# EAGLE design rart50 (EAGLE 9.6.1)
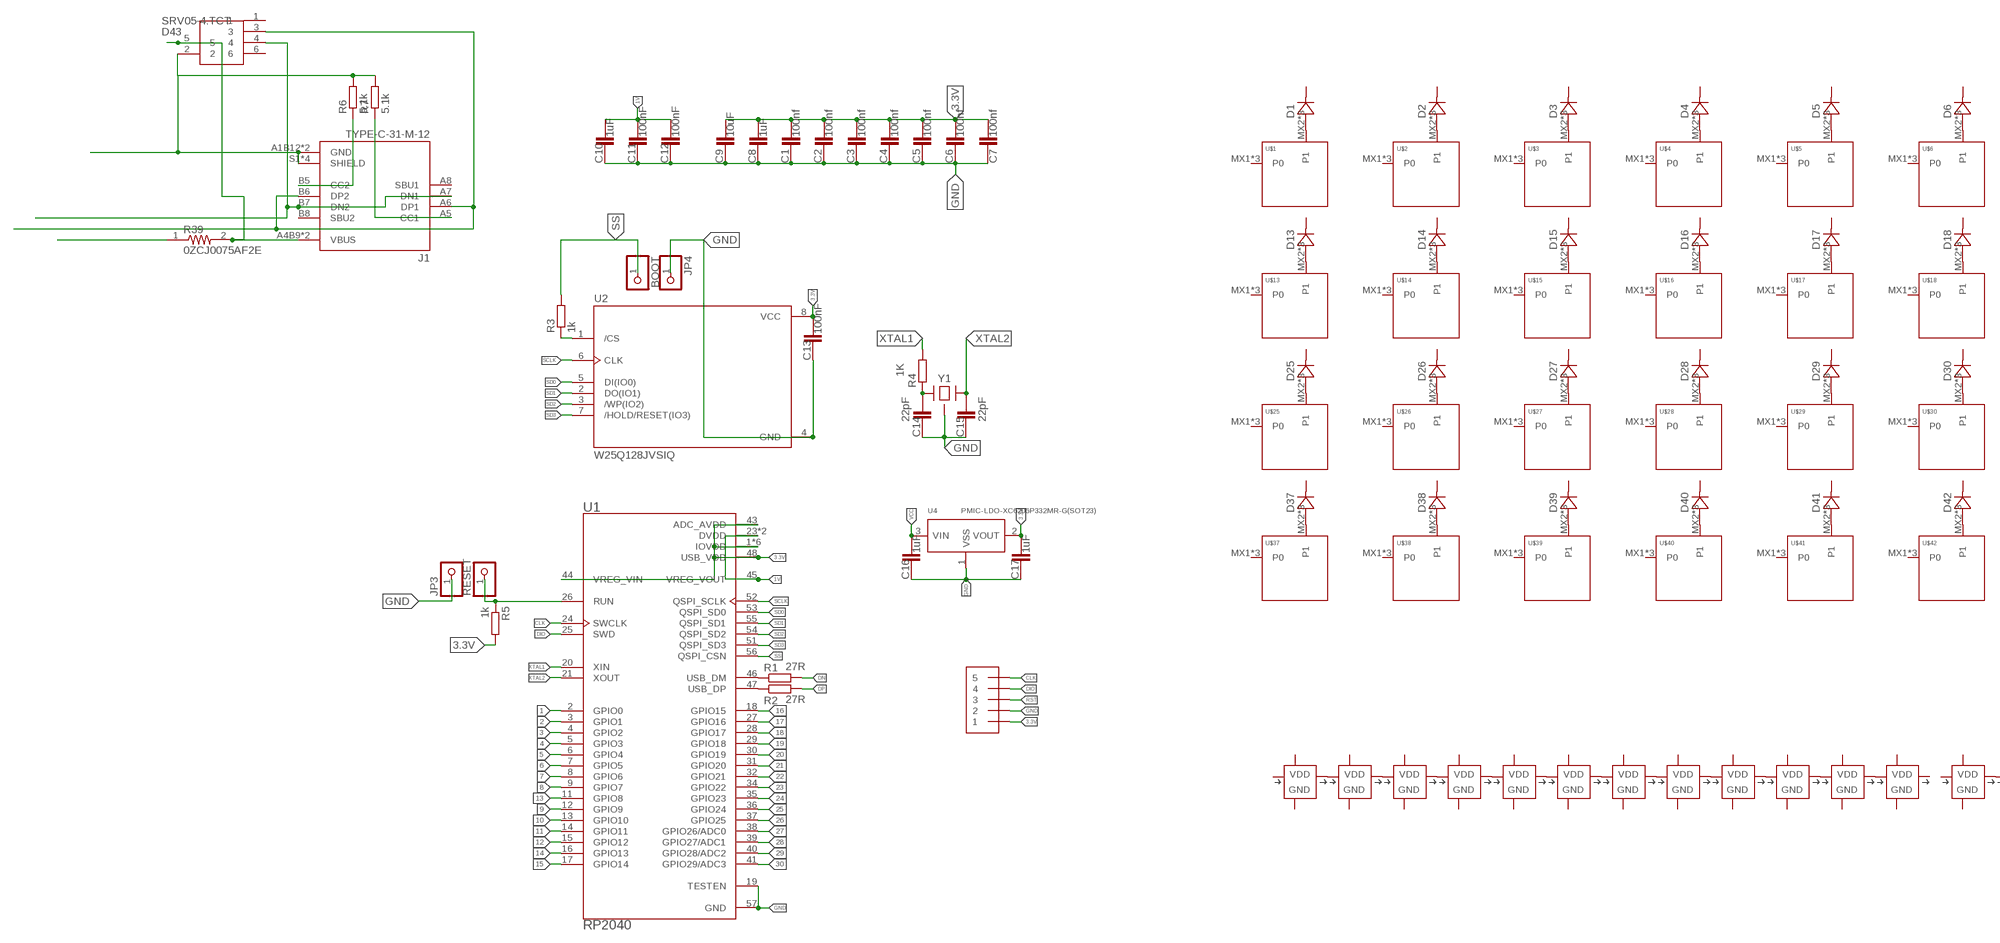
[diagram p0: schematic, sheet 1, part 1 of 2]
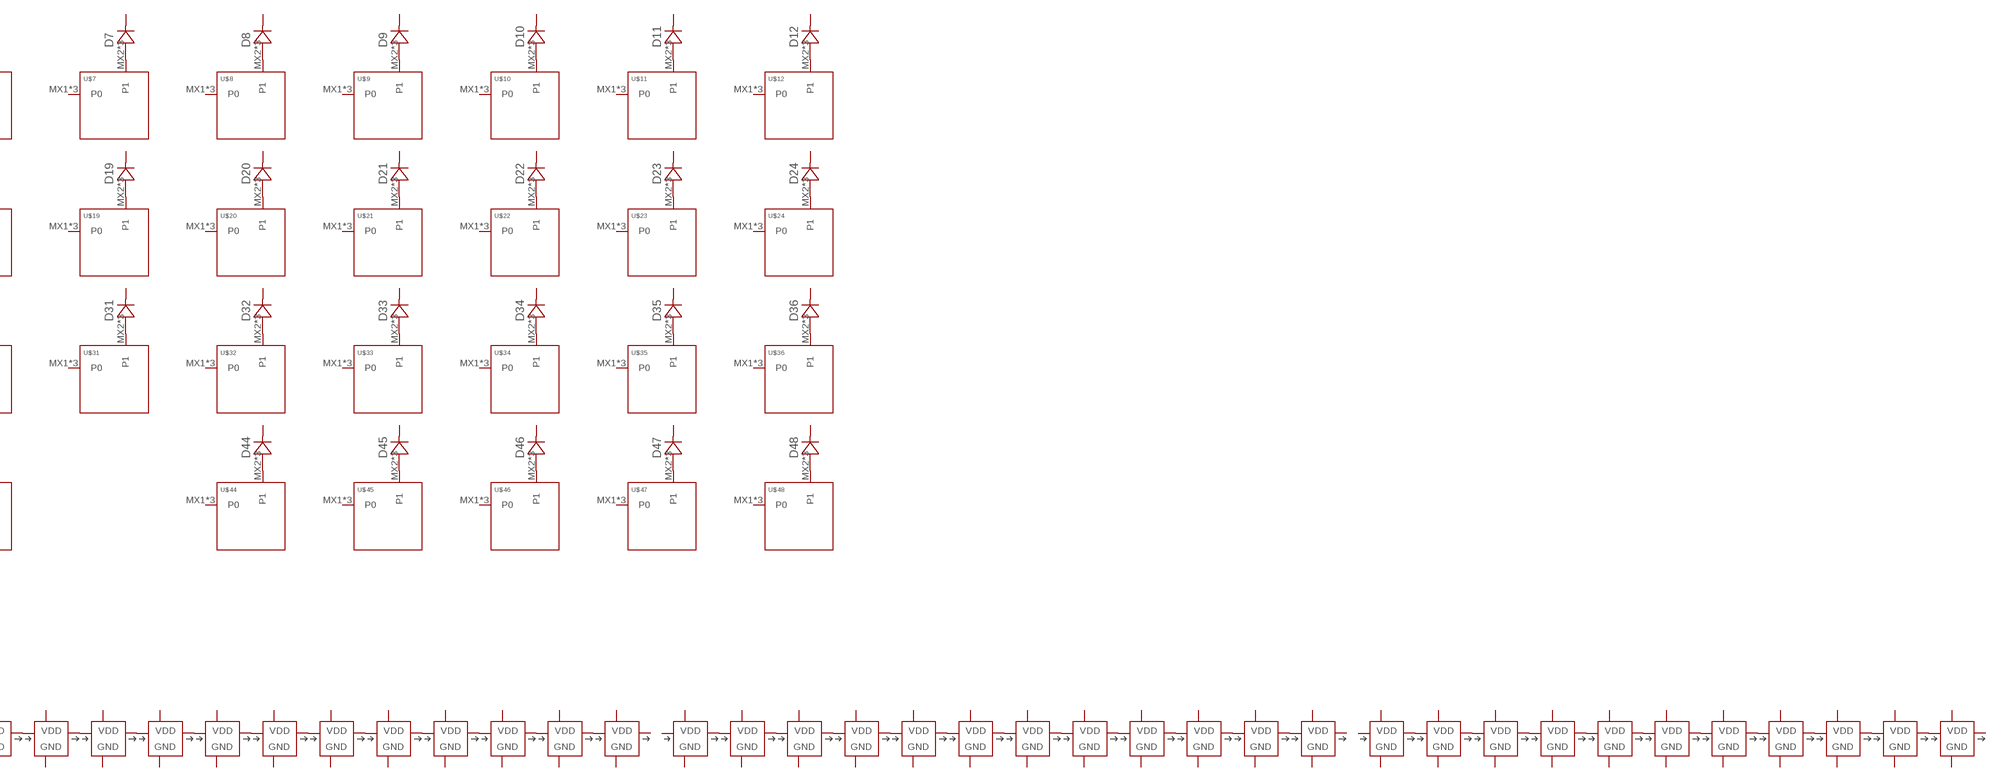
[diagram p1: schematic, sheet 1, part 2 of 2]

## Parts
BOOT  PINHD-1X1  [1X01]
C1  100nf  CAPACITOR-0603  [C0603]
C2  100nf  CAPACITOR-0603  [C0603]
C3  100nf  CAPACITOR-0603  [C0603]
C4  100nf  CAPACITOR-0603  [C0603]
C5  100nf  CAPACITOR-0603  [C0603]
C6  100nf  CAPACITOR-0603  [C0603]
C7  100nf  CAPACITOR-0603  [C0603]
C8  1uF  CAPACITOR-0603  [C0603]
C9  10uF  CAPACITOR-0603  [C0603]
C10  1uF  CAPACITOR-0603  [C0603]
C11  100nF  CAPACITOR-0603  [C0603]
C12  100nF  CAPACITOR-0603  [C0603]
C13  100nF  CAPACITOR-0603  [C0603]
C14  22pF  CAPACITOR-0603  [C0603]
C15  22pF  CAPACITOR-0603  [C0603]
C16  1uF  CAPACITOR-0603  [C0603]
C17  1uF  CAPACITOR-0603  [C0603]
D1  DIODE-SOD-123  [SOD-123]
D2  DIODE-SOD-123  [SOD-123]
D3  DIODE-SOD-123  [SOD-123]
D4  DIODE-SOD-123  [SOD-123]
D5  DIODE-SOD-123  [SOD-123]
D6  DIODE-SOD-123  [SOD-123]
D7  DIODE-SOD-123  [SOD-123]
D8  DIODE-SOD-123  [SOD-123]
D9  DIODE-SOD-123  [SOD-123]
D10  DIODE-SOD-123  [SOD-123]
D11  DIODE-SOD-123  [SOD-123]
D12  DIODE-SOD-123  [SOD-123]
D13  DIODE-SOD-123  [SOD-123]
D14  DIODE-SOD-123  [SOD-123]
D15  DIODE-SOD-123  [SOD-123]
D16  DIODE-SOD-123  [SOD-123]
D17  DIODE-SOD-123  [SOD-123]
D18  DIODE-SOD-123  [SOD-123]
D19  DIODE-SOD-123  [SOD-123]
D20  DIODE-SOD-123  [SOD-123]
D21  DIODE-SOD-123  [SOD-123]
D22  DIODE-SOD-123  [SOD-123]
D23  DIODE-SOD-123  [SOD-123]
D24  DIODE-SOD-123  [SOD-123]
D25  DIODE-SOD-123  [SOD-123]
D26  DIODE-SOD-123  [SOD-123]
D27  DIODE-SOD-123  [SOD-123]
D28  DIODE-SOD-123  [SOD-123]
D29  DIODE-SOD-123  [SOD-123]
D30  DIODE-SOD-123  [SOD-123]
D31  DIODE-SOD-123  [SOD-123]
D32  DIODE-SOD-123  [SOD-123]
D33  DIODE-SOD-123  [SOD-123]
D34  DIODE-SOD-123  [SOD-123]
D35  DIODE-SOD-123  [SOD-123]
D36  DIODE-SOD-123  [SOD-123]
D37  DIODE-SOD-123  [SOD-123]
D38  DIODE-SOD-123  [SOD-123]
D39  DIODE-SOD-123  [SOD-123]
D40  DIODE-SOD-123  [SOD-123]
D41  DIODE-SOD-123  [SOD-123]
D42  DIODE-SOD-123  [SOD-123]
D43  SRV05-4.TCT  [SOT95P280X145-6N]
D44  DIODE-SOD-123  [SOD-123]
D45  DIODE-SOD-123  [SOD-123]
D46  DIODE-SOD-123  [SOD-123]
D47  DIODE-SOD-123  [SOD-123]
D48  DIODE-SOD-123  [SOD-123]
J1  TYPE-C-31-M-12  [HRO_TYPE-C-31-M-12]
J2  1X5  [1X05-3.5MM]
JP3  PINHD-1X1CB  [1X01-CLEANBIG]
JP4  PINHD-1X1CB  [1X01-CLEANBIG]
R1  27R  RESISTOR-0603  [R0603]
R2  27R  RESISTOR-0603  [R0603]
R3  1k  RESISTOR-0603  [R0603]
R4  1K  RESISTOR-0603  [R0603]
R5  1k  RESISTOR-0603  [R0603]
R6  5.1k  RESISTOR-0603  [R0603]
R7  5.1k  RESISTOR-0603  [R0603]
R39  0ZCJ0075AF2E  [RESC3216X125N]
RESET  PINHD-1X1  [1X01]
U1  RP2040  [QFN40P700X700X90-57N]
U2  W25Q128JVSIQ  [SOIC127P790X216-8N]
U4  PMIC-LDO-XC6206P332MR-G(SOT23)  [SOT-23]
U$1  KEYSWITCH-PLAIN-MXHSPCB-1U  [MXHSPCB-1U]
U$2  KEYSWITCH-PLAIN-MXHSPCB-1U  [MXHSPCB-1U]
U$3  KEYSWITCH-PLAIN-MXHSPCB-1U  [MXHSPCB-1U]
U$4  KEYSWITCH-PLAIN-MXHSPCB-1U  [MXHSPCB-1U]
U$5  KEYSWITCH-PLAIN-MXHSPCB-1U  [MXHSPCB-1U]
U$6  KEYSWITCH-PLAIN-MXHSPCB-1U  [MXHSPCB-1U]
U$7  KEYSWITCH-PLAIN-MXHSPCB-1U  [MXHSPCB-1U]
U$8  KEYSWITCH-PLAIN-MXHSPCB-1U  [MXHSPCB-1U]
U$9  KEYSWITCH-PLAIN-MXHSPCB-1U  [MXHSPCB-1U]
U$10  KEYSWITCH-PLAIN-MXHSPCB-1U  [MXHSPCB-1U]
U$11  KEYSWITCH-PLAIN-MXHSPCB-1U  [MXHSPCB-1U]
U$12  KEYSWITCH-PLAIN-MXHSPCB-1U  [MXHSPCB-1U]
U$13  KEYSWITCH-PLAIN-MXHSPCB-1U  [MXHSPCB-1U]
U$14  KEYSWITCH-PLAIN-MXHSPCB-1U  [MXHSPCB-1U]
U$15  KEYSWITCH-PLAIN-MXHSPCB-1U  [MXHSPCB-1U]
U$16  KEYSWITCH-PLAIN-MXHSPCB-1U  [MXHSPCB-1U]
U$17  KEYSWITCH-PLAIN-MXHSPCB-1U  [MXHSPCB-1U]
U$18  KEYSWITCH-PLAIN-MXHSPCB-1U  [MXHSPCB-1U]
U$19  KEYSWITCH-PLAIN-MXHSPCB-1U  [MXHSPCB-1U]
U$20  KEYSWITCH-PLAIN-MXHSPCB-1U  [MXHSPCB-1U]
U$21  KEYSWITCH-PLAIN-MXHSPCB-1U  [MXHSPCB-1U]
U$22  KEYSWITCH-PLAIN-MXHSPCB-1U  [MXHSPCB-1U]
U$23  KEYSWITCH-PLAIN-MXHSPCB-1U  [MXHSPCB-1U]
U$24  KEYSWITCH-PLAIN-MXHSPCB-1U  [MXHSPCB-1U]
U$25  KEYSWITCH-PLAIN-MXHSPCB-1U  [MXHSPCB-1U]
U$26  KEYSWITCH-PLAIN-MXHSPCB-1U  [MXHSPCB-1U]
U$27  KEYSWITCH-PLAIN-MXHSPCB-1U  [MXHSPCB-1U]
U$28  KEYSWITCH-PLAIN-MXHSPCB-1U  [MXHSPCB-1U]
U$29  KEYSWITCH-PLAIN-MXHSPCB-1U  [MXHSPCB-1U]
U$30  KEYSWITCH-PLAIN-MXHSPCB-1U  [MXHSPCB-1U]
U$31  KEYSWITCH-PLAIN-MXHSPCB-1U  [MXHSPCB-1U]
U$32  KEYSWITCH-PLAIN-MXHSPCB-1U  [MXHSPCB-1U]
U$33  KEYSWITCH-PLAIN-MXHSPCB-1U  [MXHSPCB-1U]
U$34  KEYSWITCH-PLAIN-MXHSPCB-1U  [MXHSPCB-1U]
U$35  KEYSWITCH-PLAIN-MXHSPCB-1U  [MXHSPCB-1U]
U$36  KEYSWITCH-PLAIN-MXHSPCB-1U  [MXHSPCB-1U]
U$37  KEYSWITCH-PLAIN-MXHSPCB-1U  [MXHSPCB-1U]
U$38  KEYSWITCH-PLAIN-MXHSPCB-1U  [MXHSPCB-1U]
U$39  KEYSWITCH-PLAIN-MXHSPCB-1U  [MXHSPCB-1U]
U$40  KEYSWITCH-PLAIN-MXHSPCB-1U  [MXHSPCB-1U]
U$41  KEYSWITCH-PLAIN-MXHSPCB-1U  [MXHSPCB-1U]
U$42  KEYSWITCH-PLAIN-MXHSPCB-2U-FLIPPED  [MXHSPCB-2U-FLIPPED]
U$43  SK6812MINI  [LED-3535]
U$44  KEYSWITCH-PLAIN-MXHSPCB-1U  [MXHSPCB-1U]
U$45  KEYSWITCH-PLAIN-MXHSPCB-1U  [MXHSPCB-1U]
U$46  KEYSWITCH-PLAIN-MXHSPCB-1U  [MXHSPCB-1U]
U$47  KEYSWITCH-PLAIN-MXHSPCB-1U  [MXHSPCB-1U]
U$48  KEYSWITCH-PLAIN-MXHSPCB-1U  [MXHSPCB-1U]
U$49  SK6812MINI  [LED-3535]
U$50  SK6812MINI  [LED-3535]
U$51  SK6812MINI  [LED-3535]
U$52  SK6812MINI  [LED-3535]
U$53  SK6812MINI  [LED-3535]
U$54  SK6812MINI  [LED-3535]
U$55  SK6812MINI  [LED-3535]
U$56  SK6812MINI  [LED-3535]
U$57  SK6812MINI  [LED-3535]
U$58  SK6812MINI  [LED-3535]
U$59  SK6812MINI  [LED-3535]
U$60  SK6812MINI  [LED-3535]
U$61  SK6812MINI  [LED-3535]
U$62  SK6812MINI  [LED-3535]
U$63  SK6812MINI  [LED-3535]
U$64  SK6812MINI  [LED-3535]
U$65  SK6812MINI  [LED-3535]
U$66  SK6812MINI  [LED-3535]
U$67  SK6812MINI  [LED-3535]
U$68  SK6812MINI  [LED-3535]
U$69  SK6812MINI  [LED-3535]
U$70  SK6812MINI  [LED-3535]
U$71  SK6812MINI  [LED-3535]
U$72  SK6812MINI  [LED-3535]
U$73  SK6812MINI  [LED-3535]
U$74  SK6812MINI  [LED-3535]
U$75  SK6812MINI  [LED-3535]
U$76  SK6812MINI  [LED-3535]
U$77  SK6812MINI  [LED-3535]
U$78  SK6812MINI  [LED-3535]
U$79  SK6812MINI  [LED-3535]
U$80  SK6812MINI  [LED-3535]
U$81  SK6812MINI  [LED-3535]
U$82  SK6812MINI  [LED-3535]
U$83  SK6812MINI  [LED-3535]
U$84  SK6812MINI  [LED-3535]
U$85  SK6812MINI  [LED-3535]
U$86  SK6812MINI  [LED-3535]
U$87  SK6812MINI  [LED-3535]
U$88  SK6812MINI  [LED-3535]
U$89  SK6812MINI  [LED-3535]
U$90  SK6812MINI  [LED-3535]
U$91  SK6812MINI  [LED-3535]
U$92  SK6812MINI  [LED-3535]
U$93  SK6812MINI  [LED-3535]
U$94  SK6812MINI  [LED-3535]
Y1  CRYSTAL-4PIN-3.2X2.5  [CRYSTAL-3.2X2.5]

## Nets
1: U1.2(GPIO0)
1V: C10.2 C11.2 C12.2 U1.23(DVDD) U1.45(VREG_VOUT) U1.50(DVDD)
2: U1.3(GPIO1)
3: U1.4(GPIO2)
3.3V: C1.2 C2.2 C3.2 C4.2 C5.2 C6.2 C7.2 C8.2 C9.2 C13.2 C17.2 J2.1 R5.2 U1.1(IOVDD) U1.10(IOVDD) U1.22(IOVDD) U1.33(IOVDD) U1.42(IOVDD) U1.43(ADC_AVDD) U1.44(VREG_VIN) U1.48(USB_VDD) U1.49(IOVDD) U2.8(VCC) U4.2(VOUT)
4: U1.5(GPIO3)
5: U1.6(GPIO4)
6: U1.7(GPIO5)
7: U1.8(GPIO6)
8: U1.9(GPIO7)
9: U1.12(GPIO9)
10: U1.13(GPIO10)
11: U1.14(GPIO11)
12: U1.15(GPIO12)
13: U1.11(GPIO8)
14: U1.16(GPIO13)
15: U1.17(GPIO14)
16: U1.18(GPIO15)
17: U1.27(GPIO16)
18: U1.28(GPIO17)
19: U1.29(GPIO18)
20: U1.30(GPIO19)
21: U1.31(GPIO20)
22: U1.32(GPIO21)
23: U1.34(GPIO22)
24: U1.35(GPIO23)
25: U1.36(GPIO24)
26: U1.37(GPIO25)
27: U1.38(GPIO26/ADC0)
28: U1.39(GPIO27/ADC1)
29: U1.40(GPIO28/ADC2)
30: U1.41(GPIO29/ADC3)
CLK: J2.5 U1.24(SWCLK)
DIO: J2.4 U1.25(SWD)
DN: R1.2
DN-: D43.4 J1.A7(DN1) J1.B7(DN2)
DP: R2.2
DP+: D43.3 J1.A6(DP1) J1.B6(DP2)
GND: C1.1 C2.1 C3.1 C4.1 C5.1 C6.1 C7.1 C8.1 C9.1 C10.1 C11.1 C12.1 C13.1 C14.1 C15.1 C16.1 C17.1 J2.2 JP3.1 JP4.1 U1.19(TESTEN) U1.57(GND) U2.4(GND) U4.1(VSS) Y1.2(GND) Y1.4(GND)
GND1: D43.2 J1.A1B12(GND) J1.B1A12(GND) J1.S1(SHIELD) J1.S2(SHIELD) J1.S3(SHIELD) J1.S4(SHIELD) R6.2 R7.2
N$7: D1.A U$1.MX2(P1) U$1.P$3(P1) U$1.P$4(P1)
N$8: D2.A U$2.MX2(P1) U$2.P$3(P1) U$2.P$4(P1)
N$9: D3.A U$3.MX2(P1) U$3.P$3(P1) U$3.P$4(P1)
N$10: D4.A U$4.MX2(P1) U$4.P$3(P1) U$4.P$4(P1)
N$11: D5.A U$5.MX2(P1) U$5.P$3(P1) U$5.P$4(P1)
N$12: D6.A U$6.MX2(P1) U$6.P$3(P1) U$6.P$4(P1)
N$13: D7.A U$7.MX2(P1) U$7.P$3(P1) U$7.P$4(P1)
N$14: D8.A U$8.MX2(P1) U$8.P$3(P1) U$8.P$4(P1)
N$15: D9.A U$9.MX2(P1) U$9.P$3(P1) U$9.P$4(P1)
N$16: D10.A U$10.MX2(P1) U$10.P$3(P1) U$10.P$4(P1)
N$17: D11.A U$11.MX2(P1) U$11.P$3(P1) U$11.P$4(P1)
N$18: D12.A U$12.MX2(P1) U$12.P$3(P1) U$12.P$4(P1)
N$19: D13.A U$13.MX2(P1) U$13.P$3(P1) U$13.P$4(P1)
N$20: D14.A U$14.MX2(P1) U$14.P$3(P1) U$14.P$4(P1)
N$21: D15.A U$15.MX2(P1) U$15.P$3(P1) U$15.P$4(P1)
N$22: D16.A U$16.MX2(P1) U$16.P$3(P1) U$16.P$4(P1)
N$23: D17.A U$17.MX2(P1) U$17.P$3(P1) U$17.P$4(P1)
N$24: D18.A U$18.MX2(P1) U$18.P$3(P1) U$18.P$4(P1)
N$25: D19.A U$19.MX2(P1) U$19.P$3(P1) U$19.P$4(P1)
N$26: D20.A U$20.MX2(P1) U$20.P$3(P1) U$20.P$4(P1)
N$27: D21.A U$21.MX2(P1) U$21.P$3(P1) U$21.P$4(P1)
N$28: D22.A U$22.MX2(P1) U$22.P$3(P1) U$22.P$4(P1)
N$29: D23.A U$23.MX2(P1) U$23.P$3(P1) U$23.P$4(P1)
N$30: D24.A U$24.MX2(P1) U$24.P$3(P1) U$24.P$4(P1)
N$31: D25.A U$25.MX2(P1) U$25.P$3(P1) U$25.P$4(P1)
N$32: D26.A U$26.MX2(P1) U$26.P$3(P1) U$26.P$4(P1)
N$33: D27.A U$27.MX2(P1) U$27.P$3(P1) U$27.P$4(P1)
N$34: D28.A U$28.MX2(P1) U$28.P$3(P1) U$28.P$4(P1)
N$35: D29.A U$29.MX2(P1) U$29.P$3(P1) U$29.P$4(P1)
N$36: D30.A U$30.MX2(P1) U$30.P$3(P1) U$30.P$4(P1)
N$37: D31.A U$31.MX2(P1) U$31.P$3(P1) U$31.P$4(P1)
N$38: D32.A U$32.MX2(P1) U$32.P$3(P1) U$32.P$4(P1)
N$39: D33.A U$33.MX2(P1) U$33.P$3(P1) U$33.P$4(P1)
N$40: D34.A U$34.MX2(P1) U$34.P$3(P1) U$34.P$4(P1)
N$41: D35.A U$35.MX2(P1) U$35.P$3(P1) U$35.P$4(P1)
N$42: D36.A U$36.MX2(P1) U$36.P$3(P1) U$36.P$4(P1)
N$43: D37.A U$37.MX2(P1) U$37.P$3(P1) U$37.P$4(P1)
N$44: D38.A U$38.MX2(P1) U$38.P$3(P1) U$38.P$4(P1)
N$45: D39.A U$39.MX2(P1) U$39.P$3(P1) U$39.P$4(P1)
N$46: D40.A U$40.MX2(P1) U$40.P$3(P1) U$40.P$4(P1)
N$47: D41.A U$41.MX2(P1) U$41.P$3(P1) U$41.P$4(P1)
N$48: D42.A U$42.MX2(P1) U$42.P$3(P1) U$42.P$4(P1)
N$49: D44.A U$44.MX2(P1) U$44.P$3(P1) U$44.P$4(P1)
N$50: D45.A U$45.MX2(P1) U$45.P$3(P1) U$45.P$4(P1)
N$51: D46.A U$46.MX2(P1) U$46.P$3(P1) U$46.P$4(P1)
N$52: D47.A U$47.MX2(P1) U$47.P$3(P1) U$47.P$4(P1)
N$53: D48.A U$48.MX2(P1) U$48.P$3(P1) U$48.P$4(P1)
N$54: U$43.3(DO) U$49.1(DI)
N$55: U$49.3(DO) U$50.1(DI)
N$56: U$50.3(DO) U$51.1(DI)
N$57: U$51.3(DO) U$52.1(DI)
N$58: U$52.3(DO) U$53.1(DI)
N$59: U$53.3(DO) U$54.1(DI)
N$60: U$54.3(DO) U$55.1(DI)
N$61: U$55.3(DO) U$56.1(DI)
N$62: U$56.3(DO) U$57.1(DI)
N$63: U$57.3(DO) U$58.1(DI)
N$64: U$58.3(DO) U$59.1(DI)
N$65: U$60.3(DO) U$61.1(DI)
N$66: U$61.3(DO) U$62.1(DI)
N$67: U$62.3(DO) U$63.1(DI)
N$68: U$63.3(DO) U$64.1(DI)
N$69: U$64.3(DO) U$65.1(DI)
N$70: U$65.3(DO) U$66.1(DI)
N$71: U$66.3(DO) U$67.1(DI)
N$72: U$67.3(DO) U$68.1(DI)
N$73: U$68.3(DO) U$69.1(DI)
N$74: U$69.3(DO) U$70.1(DI)
N$75: U$70.3(DO) U$71.1(DI)
N$76: U$72.3(DO) U$73.1(DI)
N$77: U$73.3(DO) U$74.1(DI)
N$78: U$74.3(DO) U$75.1(DI)
N$79: U$75.3(DO) U$76.1(DI)
N$80: U$76.3(DO) U$77.1(DI)
N$81: U$77.3(DO) U$78.1(DI)
N$82: U$78.3(DO) U$79.1(DI)
N$83: U$79.3(DO) U$80.1(DI)
N$84: U$80.3(DO) U$81.1(DI)
N$85: U$81.3(DO) U$82.1(DI)
N$86: U$82.3(DO) U$83.1(DI)
N$87: U$84.3(DO) U$85.1(DI)
N$88: U$85.3(DO) U$86.1(DI)
N$89: U$86.3(DO) U$87.1(DI)
N$90: U$87.3(DO) U$88.1(DI)
N$91: U$88.3(DO) U$89.1(DI)
N$92: U$89.3(DO) U$90.1(DI)
N$93: U$90.3(DO) U$91.1(DI)
N$94: U$91.3(DO) U$92.1(DI)
N$95: U$92.3(DO) U$93.1(DI)
N$96: U$93.3(DO) U$94.1(DI)
N$97: R1.1 U1.46(USB_DM)
N$98: R2.1 U1.47(USB_DP)
N$99: C14.2 R4.1 Y1.1
N$100: R3.1 U2.1(/CS)
N$101: D43.5 J1.A4B9(VBUS) J1.B4A9(VBUS) R39.2
N$153: J1.B5(CC2) R6.1
N$154: J1.A5(CC1) R7.1
RST: J2.3 R5.1 RESET.1 U1.26(RUN)
SCLK: U1.52(QSPI_SCLK) U2.6(CLK)
SD0: U1.53(QSPI_SD0) U2.5(DI(IO0))
SD1: U1.55(QSPI_SD1) U2.2(DO(IO1))
SD2: U1.54(QSPI_SD2) U2.3(/WP(IO2))
SD3: U1.51(QSPI_SD3) U2.7(/HOLD/RESET(IO3))
SS: BOOT.1 R3.2 U1.56(QSPI_CSN)
VCC: C16.2 U4.3(VIN)
VCC1: R39.1
XTAL1: R4.2 U1.20(XIN)
XTAL2: C15.2 U1.21(XOUT) Y1.3
Unconnected: D1.C D2.C D3.C D4.C D5.C D6.C D7.C D8.C D9.C D10.C D11.C D12.C D13.C D14.C D15.C D16.C D17.C D18.C D19.C D20.C D21.C D22.C D23.C D24.C D25.C D26.C D27.C D28.C D29.C D30.C D31.C D32.C D33.C D34.C D35.C D36.C D37.C D38.C D39.C D40.C D41.C D42.C D43.1 D43.6 D44.C D45.C D46.C D47.C D48.C J1.A8(SBU1) J1.B8(SBU2) U$1.MX1(P0) U$1.P$1(P0) U$1.P$2(P0) U$2.MX1(P0) U$2.P$1(P0) U$2.P$2(P0) U$3.MX1(P0) U$3.P$1(P0) U$3.P$2(P0) U$4.MX1(P0) U$4.P$1(P0) U$4.P$2(P0) U$5.MX1(P0) U$5.P$1(P0) U$5.P$2(P0) U$6.MX1(P0) U$6.P$1(P0) U$6.P$2(P0) U$7.MX1(P0) U$7.P$1(P0) U$7.P$2(P0) U$8.MX1(P0) U$8.P$1(P0) U$8.P$2(P0) U$9.MX1(P0) U$9.P$1(P0) U$9.P$2(P0) U$10.MX1(P0) U$10.P$1(P0) U$10.P$2(P0) U$11.MX1(P0) U$11.P$1(P0) U$11.P$2(P0) U$12.MX1(P0) U$12.P$1(P0) U$12.P$2(P0) U$13.MX1(P0) U$13.P$1(P0) U$13.P$2(P0) U$14.MX1(P0) U$14.P$1(P0) U$14.P$2(P0) U$15.MX1(P0) U$15.P$1(P0) U$15.P$2(P0) U$16.MX1(P0) U$16.P$1(P0) U$16.P$2(P0) U$17.MX1(P0) U$17.P$1(P0) U$17.P$2(P0) U$18.MX1(P0) U$18.P$1(P0) U$18.P$2(P0) U$19.MX1(P0) U$19.P$1(P0) U$19.P$2(P0) U$20.MX1(P0) U$20.P$1(P0) U$20.P$2(P0) U$21.MX1(P0) U$21.P$1(P0) U$21.P$2(P0) U$22.MX1(P0) U$22.P$1(P0) U$22.P$2(P0) U$23.MX1(P0) U$23.P$1(P0) U$23.P$2(P0) U$24.MX1(P0) U$24.P$1(P0) U$24.P$2(P0) U$25.MX1(P0) U$25.P$1(P0) U$25.P$2(P0) U$26.MX1(P0) U$26.P$1(P0) U$26.P$2(P0) U$27.MX1(P0) U$27.P$1(P0) U$27.P$2(P0) U$28.MX1(P0) U$28.P$1(P0) U$28.P$2(P0) U$29.MX1(P0) U$29.P$1(P0) U$29.P$2(P0) U$30.MX1(P0) U$30.P$1(P0) U$30.P$2(P0) U$31.MX1(P0) U$31.P$1(P0) U$31.P$2(P0) U$32.MX1(P0) U$32.P$1(P0) U$32.P$2(P0) U$33.MX1(P0) U$33.P$1(P0) U$33.P$2(P0) U$34.MX1(P0) U$34.P$1(P0) U$34.P$2(P0) U$35.MX1(P0) U$35.P$1(P0) U$35.P$2(P0) U$36.MX1(P0) U$36.P$1(P0) U$36.P$2(P0) U$37.MX1(P0) U$37.P$1(P0) U$37.P$2(P0) U$38.MX1(P0) U$38.P$1(P0) U$38.P$2(P0) U$39.MX1(P0) U$39.P$1(P0) U$39.P$2(P0) U$40.MX1(P0) U$40.P$1(P0) U$40.P$2(P0) U$41.MX1(P0) U$41.P$1(P0) U$41.P$2(P0) U$42.MX1(P0) U$42.P$1(P0) U$42.P$2(P0) U$43.1(DI) U$44.MX1(P0) U$44.P$1(P0) U$44.P$2(P0) U$45.MX1(P0) U$45.P$1(P0) U$45.P$2(P0) U$46.MX1(P0) U$46.P$1(P0) U$46.P$2(P0) U$47.MX1(P0) U$47.P$1(P0) U$47.P$2(P0) U$48.MX1(P0) U$48.P$1(P0) U$48.P$2(P0) U$59.3(DO) U$60.1(DI) U$71.3(DO) U$72.1(DI) U$83.3(DO) U$84.1(DI) U$94.3(DO)

## Power pins joined to a net without a drawn wire
GND: U$43.2(GND) U$49.2(GND) U$50.2(GND) U$51.2(GND) U$52.2(GND) U$53.2(GND) U$54.2(GND) U$55.2(GND) U$56.2(GND) U$57.2(GND) U$58.2(GND) U$59.2(GND) U$60.2(GND) U$61.2(GND) U$62.2(GND) U$63.2(GND) U$64.2(GND) U$65.2(GND) U$66.2(GND) U$67.2(GND) U$68.2(GND) U$69.2(GND) U$70.2(GND) U$71.2(GND) U$72.2(GND) U$73.2(GND) U$74.2(GND) U$75.2(GND) U$76.2(GND) U$77.2(GND) U$78.2(GND) U$79.2(GND) U$80.2(GND) U$81.2(GND) U$82.2(GND) U$83.2(GND) U$84.2(GND) U$85.2(GND) U$86.2(GND) U$87.2(GND) U$88.2(GND) U$89.2(GND) U$90.2(GND) U$91.2(GND) U$92.2(GND) U$93.2(GND) U$94.2(GND)
VDD: U$43.4(VDD) U$49.4(VDD) U$50.4(VDD) U$51.4(VDD) U$52.4(VDD) U$53.4(VDD) U$54.4(VDD) U$55.4(VDD) U$56.4(VDD) U$57.4(VDD) U$58.4(VDD) U$59.4(VDD) U$60.4(VDD) U$61.4(VDD) U$62.4(VDD) U$63.4(VDD) U$64.4(VDD) U$65.4(VDD) U$66.4(VDD) U$67.4(VDD) U$68.4(VDD) U$69.4(VDD) U$70.4(VDD) U$71.4(VDD) U$72.4(VDD) U$73.4(VDD) U$74.4(VDD) U$75.4(VDD) U$76.4(VDD) U$77.4(VDD) U$78.4(VDD) U$79.4(VDD) U$80.4(VDD) U$81.4(VDD) U$82.4(VDD) U$83.4(VDD) U$84.4(VDD) U$85.4(VDD) U$86.4(VDD) U$87.4(VDD) U$88.4(VDD) U$89.4(VDD) U$90.4(VDD) U$91.4(VDD) U$92.4(VDD) U$93.4(VDD) U$94.4(VDD)

## Library data of the parts
BOOT JP3 JP4 RESET = adafruit:PINHD-1X1: Pin header 1x1 for 0.1" spacing With round pins
C1-C17 = Components:CAPACITOR
D1-D42 D44-D48 = Components:DIODE: Standard 1N4148 diode
D43 = SRV05-4.TCT:SRV05-4.TCT: Semtech SRV05-4.TCT, Uni-Directional TVS Diode Array, 300W, 6-Pin SOT-23 Source: Datasheet <https://componentsearchengine.com/Datasheets/1/SRV05-4.TCT.pdf> Check prices <https://pricing.snapeda.com/parts/SRV05-4.TC/Semtech/view-part?ref=eda>; AVAILABILITY: In Stock; DESCRIPTION: 17.5V Clamp 12A (8/20µs) Ipp Tvs Diode Surface Mount SOT-23-6; MF: Semtech; MP: SRV05-4.TC; PACKAGE: SOT-23-6 Semtech; PRICE: None; PURCHASE-URL: https://pricing.snapeda.com/search/part/SRV05-4.TC/?ref=eda
J1 = TYPE-C-31-M-12:TYPE-C-31-M-12: USB Connectors 24 Receptacle 1 8.94*7.3mm RoHS; AVAILABILITY: Unavailable; DESCRIPTION: USB Connectors 24 Receptacle 1 8.94*7.3mm RoHS; MF: HRO Electronics Co., Ltd.; MP: TYPE-C-31-M-12; PACKAGE: Package; PRICE: None
J2 = adafruit:1X5
R1-R7 = Components:RESISTOR
R39 = fuse:0ZCJ0075AF2E: PTC RESTTBLE 0.75A 16V CHIP 1206 Check prices <https://pricing.snapeda.com/parts/0ZCJ0075AF2E/Bel%20Fuse/view-part?ref=eda>; AVAILABILITY: In Stock; DESCRIPTION: 1206 SMT PPTC | 0.75 Ih | 16V; MF: Bel Fuse; MP: 0ZCJ0075AF2E; PACKAGE: 1206 Bel Fuse; PRICE: None; PURCHASE-URL: https://pricing.snapeda.com/search/part/0ZCJ0075AF2E/?ref=eda
U1 = RP2040:RP2040: Check availability <https://pricing.snapeda.com/parts/RP2040/Raspberry%20Pi/view-part?ref=eda>; AVAILABILITY: In Stock; DESCRIPTION: RP2040 chip for Raspberry Pi Pico - ARM® Cortex®-M0+ MCU 32-Bit; MF: Raspberry Pi; MP: RP2040; PACKAGE: None; PRICE: None; PURCHASE-URL: https://pricing.snapeda.com/search/part/RP2040/?ref=eda
U2 = W25Q128JVSIQ:W25Q128JVSIQ: Check availability <https://pricing.snapeda.com/parts/W25Q128JVSIQ/Winbond%20Electronics/view-part?ref=eda>; AVAILABILITY: In Stock; DESCRIPTION: FLASH - NOR Memory IC 128Mb (16M x 8) SPI - Quad I/O, QPI, DTR 133 MHz 8-SOIC; MF: Winbond Electronics; MP: W25Q128JVSIQ; PACKAGE: SOIC-8 Winbond; PRICE: None; PURCHASE-URL: https://pricing.snapeda.com/search/part/W25Q128JVSIQ/?ref=eda
U4 = C5446-XC6206P332MR-G_SOT23_:PMIC-LDO-XC6206P332MR-G(SOT23): 310030099 Check availability <https://pricing.snapeda.com/parts/XC6206P332MR-G/Torex/view-part?ref=eda>; AVAILABILITY: In Stock; DESCRIPTION: Linear Voltage Regulator IC Positive Fixed 1 Output 200mA SOT-23; MF: Torex; MP: XC6206P332MR-G; PACKAGE: SOT-23-3 Torex; PRICE: None; PURCHASE-URL: https://pricing.snapeda.com/search/part/XC6206P332MR-G/?ref=eda
U$1-U$42 U$44-U$48 = Keyboard:KEYSWITCH-PLAIN
U$43 U$49-U$94 = SK6812MINI:SK6812MINI: Check availability <https://pricing.snapeda.com/parts/SK6812MINI/DONGGUANG%20OPSCO%20OPTOELECTRONICS%20CO.%2C%20LTD/view-part?ref=eda>; AVAILABILITY: Not in stock; DESCRIPTION: INTEGRATED LIGHT SOURCE INTELLIGENT CONTROL OF CHIP-ON-TOP SMD TYPE LED; MF: DONGGUANG OPSCO OPTOELECTRONICS CO., LTD; MP: SK6812MINI; PACKAGE: Package; PRICE: None
Y1 = Components:CRYSTAL-4PIN

## Board
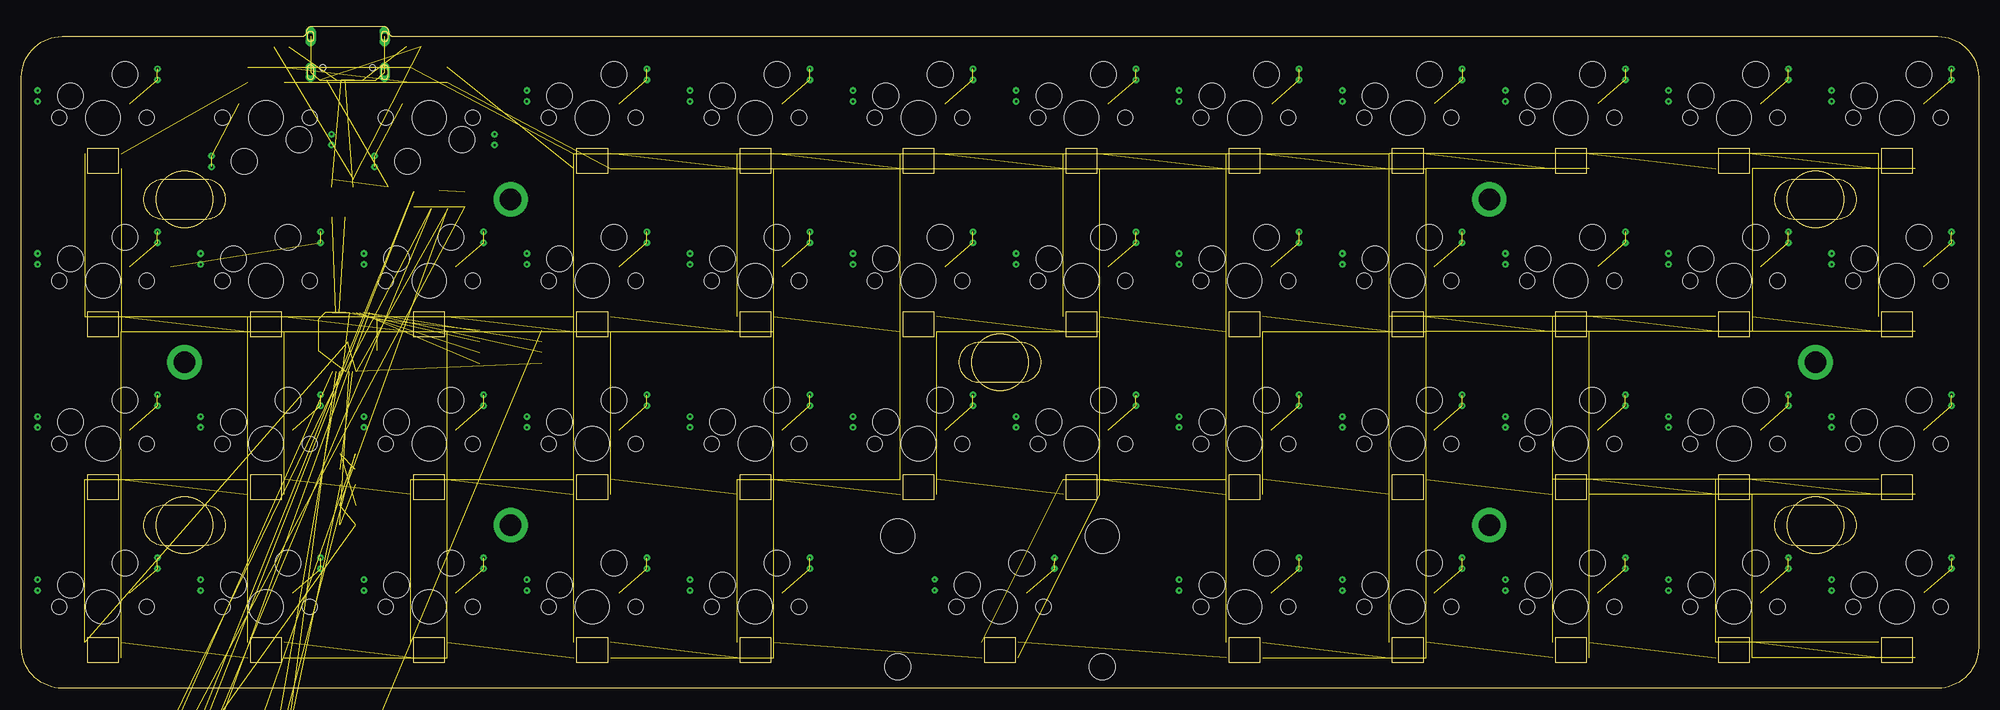
[diagram p2: board, top side]
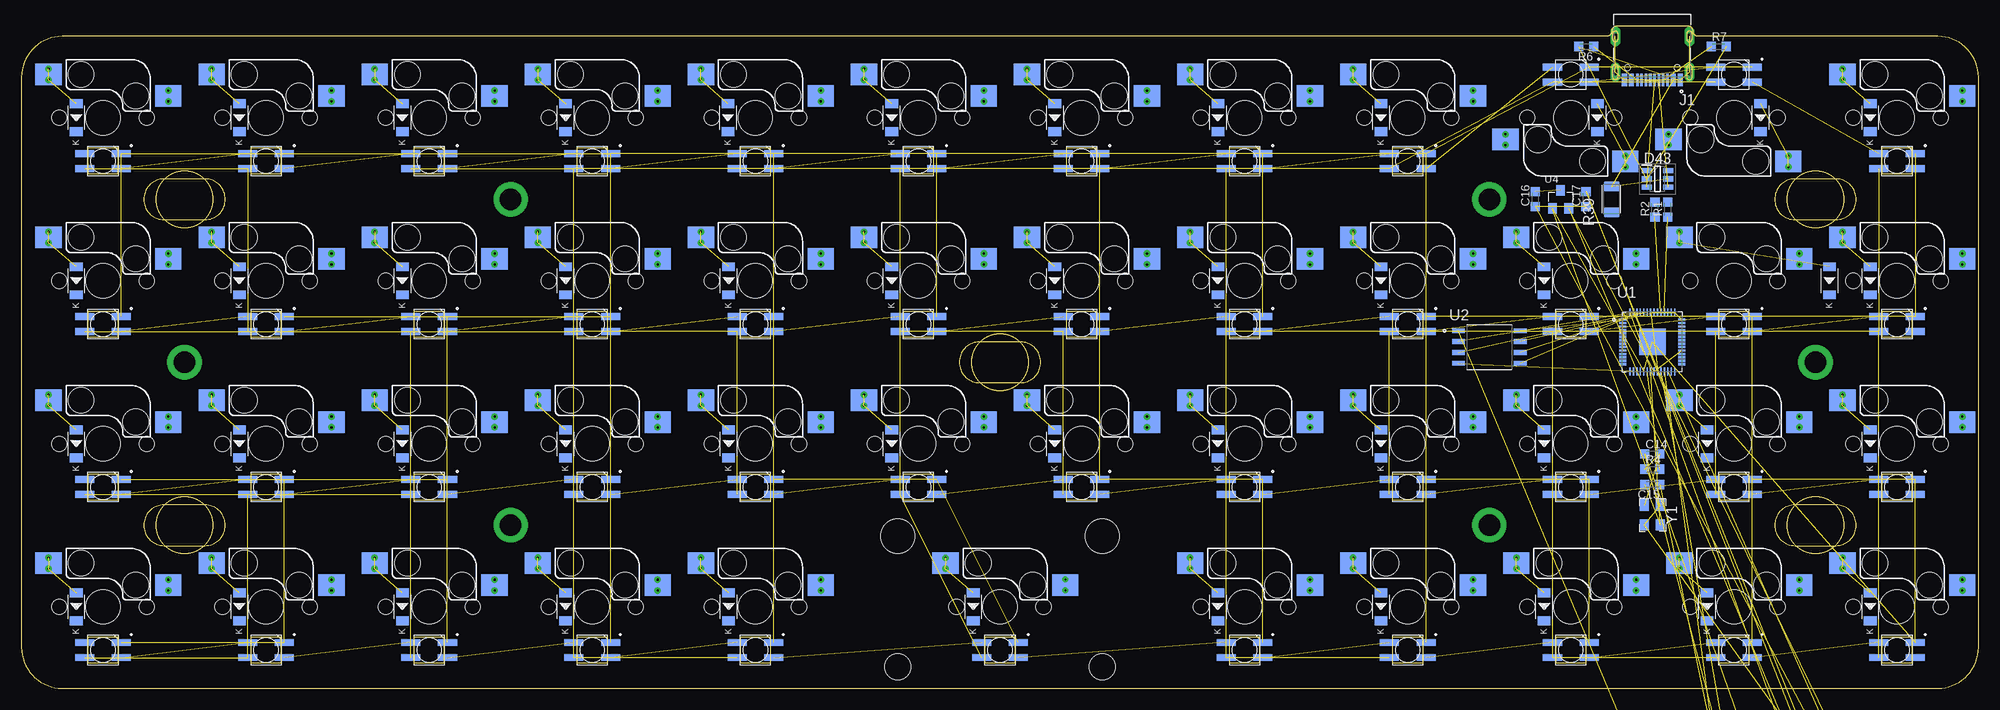
[diagram p3: board, bottom side, seen from below]

Size 228 x 77.19 mm. Coordinates in mm from the lower left corner, seen from the top.
Outline: 228,71.25 228,4.75
Outline: 0,71.25 arc-90 4.75,76
Outline: 4.75,0 arc-90 0,4.75
Outline: 228,4.75 arc-90 223.25,0
Outline: 223.25,76 arc-90 228,71.25
Outline: 223.25,76 arc-90 228,71.25
Outline: 228,4.75 arc-90 223.25,0
Outline: 223.25,0 4.75,0
Outline: 4.75,0 arc-90 0,4.75
Outline: 0,4.75 0,71.25
Outline: 0,71.25 arc-90 4.75,76
Outline: 4.75,76 32.66,76 arc90 33.25,76.59 arc-90 33.84,77.19 42.16,77.19 arc-90 42.75,76.59 arc90 43.34,76 223.25,76
Outline: 223.25,76 arc-90 228,71.25
Outline: 14.25,57 arc-90 16.62,59.38 21.38,59.38 arc-90 23.75,57 arc-90 21.38,54.62 16.62,54.62 arc-90 14.25,57
Outline: 14.25,19 arc-90 16.62,21.38 21.38,21.38 arc-90 23.75,19 arc-90 21.38,16.62 16.62,16.62 arc-90 14.25,19
Outline: 109.25,38 arc-90 111.62,40.38 116.38,40.38 arc-90 118.75,38 arc-90 116.38,35.62 111.62,35.62 arc-90 109.25,38
Outline: 204.25,57 arc-90 206.62,59.38 211.38,59.38 arc-90 213.75,57 arc-90 211.38,54.62 206.62,54.62 arc-90 204.25,57
Outline: 204.25,19 arc-90 206.62,21.38 211.38,21.38 arc-90 213.75,19 arc-90 211.38,16.62 206.62,16.62 arc-90 204.25,19
Outline: 7.72,62.94 11.28,62.94 11.28,59.97 7.72,59.97 7.72,62.94
Outline: 64.72,62.94 68.28,62.94 68.28,59.97 64.72,59.97 64.72,62.94
Outline: 83.72,62.94 87.28,62.94 87.28,59.97 83.72,59.97 83.72,62.94
Outline: 102.72,62.94 106.28,62.94 106.28,59.97 102.72,59.97 102.72,62.94
Outline: 121.72,62.94 125.28,62.94 125.28,59.97 121.72,59.97 121.72,62.94
Outline: 140.72,62.94 144.28,62.94 144.28,59.97 140.72,59.97 140.72,62.94
Outline: 159.72,62.94 163.28,62.94 163.28,59.97 159.72,59.97 159.72,62.94
Outline: 178.72,62.94 182.28,62.94 182.28,59.97 178.72,59.97 178.72,62.94
Outline: 197.72,62.94 201.28,62.94 201.28,59.97 197.72,59.97 197.72,62.94
Outline: 216.72,62.94 220.28,62.94 220.28,59.97 216.72,59.97 216.72,62.94
Outline: 64.72,43.94 68.28,43.94 68.28,40.97 64.72,40.97 64.72,43.94
Outline: 83.72,43.94 87.28,43.94 87.28,40.97 83.72,40.97 83.72,43.94
Outline: 102.72,43.94 106.28,43.94 106.28,40.97 102.72,40.97 102.72,43.94
Outline: 121.72,43.94 125.28,43.94 125.28,40.97 121.72,40.97 121.72,43.94
Outline: 140.72,43.94 144.28,43.94 144.28,40.97 140.72,40.97 140.72,43.94
Outline: 159.72,43.94 163.28,43.94 163.28,40.97 159.72,40.97 159.72,43.94
Outline: 178.72,43.94 182.28,43.94 182.28,40.97 178.72,40.97 178.72,43.94
Outline: 197.72,43.94 201.28,43.94 201.28,40.97 197.72,40.97 197.72,43.94
Outline: 216.72,43.94 220.28,43.94 220.28,40.97 216.72,40.97 216.72,43.94
Outline: 64.72,24.94 68.28,24.94 68.28,21.97 64.72,21.97 64.72,24.94
Outline: 83.72,24.94 87.28,24.94 87.28,21.97 83.72,21.97 83.72,24.94
Outline: 102.72,24.94 106.28,24.94 106.28,21.97 102.72,21.97 102.72,24.94
Outline: 121.72,24.94 125.28,24.94 125.28,21.97 121.72,21.97 121.72,24.94
Outline: 140.72,24.94 144.28,24.94 144.28,21.97 140.72,21.97 140.72,24.94
Outline: 159.72,24.94 163.28,24.94 163.28,21.97 159.72,21.97 159.72,24.94
Outline: 178.72,24.94 182.28,24.94 182.28,21.97 178.72,21.97 178.72,24.94
Outline: 197.72,24.94 201.28,24.94 201.28,21.97 197.72,21.97 197.72,24.94
Outline: 216.72,24.94 220.28,24.94 220.28,21.97 216.72,21.97 216.72,24.94
Outline: 64.72,5.94 68.28,5.94 68.28,2.97 64.72,2.97 64.72,5.94
Outline: 83.72,5.94 87.28,5.94 87.28,2.97 83.72,2.97 83.72,5.94
Outline: 112.22,5.94 115.78,5.94 115.78,2.97 112.22,2.97 112.22,5.94
Outline: 7.72,43.94 11.28,43.94 11.28,40.97 7.72,40.97 7.72,43.94
Outline: 140.72,5.94 144.28,5.94 144.28,2.97 140.72,2.97 140.72,5.94
Outline: 159.72,5.94 163.28,5.94 163.28,2.97 159.72,2.97 159.72,5.94
Outline: 178.72,5.94 182.28,5.94 182.28,2.97 178.72,2.97 178.72,5.94
Outline: 197.72,5.94 201.28,5.94 201.28,2.97 197.72,2.97 197.72,5.94
Outline: 216.72,5.94 220.28,5.94 220.28,2.97 216.72,2.97 216.72,5.94
Outline: 26.72,43.94 30.28,43.94 30.28,40.97 26.72,40.97 26.72,43.94
Outline: 45.72,43.94 49.28,43.94 49.28,40.97 45.72,40.97 45.72,43.94
Outline: 7.72,24.94 11.28,24.94 11.28,21.97 7.72,21.97 7.72,24.94
Outline: 26.72,24.94 30.28,24.94 30.28,21.97 26.72,21.97 26.72,24.94
Outline: 45.72,24.94 49.28,24.94 49.28,21.97 45.72,21.97 45.72,24.94
Outline: 7.72,5.94 11.28,5.94 11.28,2.97 7.72,2.97 7.72,5.94
Outline: 26.72,5.94 30.28,5.94 30.28,2.97 26.72,2.97 26.72,5.94
Outline: 45.72,5.94 49.28,5.94 49.28,2.97 45.72,2.97 45.72,5.94
Outline: circle at 19,57 radius 3.3
Outline: circle at 19,19 radius 3.3
Outline: circle at 114,38 radius 3.3
Outline: circle at 209,57 radius 3.3
Outline: circle at 209,19 radius 3.3
Copper layers (1*16): Top 0.035mm / dielectric 1.5mm / Bottom 0.035mm
Design rules "default *": minimum track width 6mil, minimum drill 0.35mm, track to track 6mil, track to pad 6mil, pad to pad 6mil, via to via 6mil, smd to smd 6mil, copper to edge 15mil, drill to drill 6mil, minimum pad ring 10mil, minimum via ring 8mil, stop-mask expansion 4mil, vias tented up to drill 14mil, thermal gap 10mil

### Footprints (pad centres in the part's own frame; a part is rotated, then mirrored left to right if it is on the bottom)
1X01 = drill 1.016 pad 1.93 octagon: 1 0,0
C0603 = smd 1.05 x 1.08: 1 -0.875,0; 2 0.875,0
SOD-123 = smd 1.037 x 1.474: A -1.635,0; C 1.635,0
SOT95P280X145-6N = smd 1.15 x 0.6: 1 -1.25,0.95; 2 -1.25,0; 3 -1.25,-0.95; 4 1.25,-0.95; 5 1.25,0; 6 1.25,0.95
HRO_TYPE-C-31-M-12 = smd 0.6 x 1.45: A1B12 -3.25,5.095; A4B9 -2.45,5.095; B1A12 3.25,5.095; B4A9 2.45,5.095 | smd 0.3 x 1.45: A5 -1.25,5.095; A6 -0.25,5.095; A7 0.25,5.095; A8 1.25,5.095; B5 1.75,5.095; B6 0.75,5.095; B7 -0.75,5.095; B8 -1.75,5.095 | drill 0.65 pad 1.05 long: S1 -4.32,4.18; S2 4.32,4.18; S3 -4.32,0; S4 4.32,0 | hole 0.7: -2.89,3.65; 2.89,3.65
1X05-3.5MM = drill 0.55 pad 1.27: 1 4,0; 2 2,0; 3 0,0; 4 -2,0; 5 -4,0
1X01-CLEANBIG = drill 1.016 pad 1.778: 1 0,0
R0603 = smd 1.05 x 1.08: 1 -0.875,0; 2 0.875,0
RESC3216X125N = smd 1.2 x 1.82: 1 -1.505,0; 2 1.505,0
QFN40P700X700X90-57N = smd 0.84 x 0.2: 1 -3.435,2.6; 2 -3.435,2.2; 3 -3.435,1.8; 4 -3.435,1.4; 5 -3.435,1; 6 -3.435,0.6; 7 -3.435,0.2; 8 -3.435,-0.2; 9 -3.435,-0.6; 10 -3.435,-1; 11 -3.435,-1.4; 12 -3.435,-1.8; 13 -3.435,-2.2; 14 -3.435,-2.6; 29 3.435,-2.6; 30 3.435,-2.2; 31 3.435,-1.8; 32 3.435,-1.4; 33 3.435,-1; 34 3.435,-0.6; 35 3.435,-0.2; 36 3.435,0.2; 37 3.435,0.6; 38 3.435,1; 39 3.435,1.4; 40 3.435,1.8; 41 3.435,2.2; 42 3.435,2.6 | smd 0.2 x 0.84: 15 -2.6,-3.435; 16 -2.2,-3.435; 17 -1.8,-3.435; 18 -1.4,-3.435; 19 -1,-3.435; 20 -0.6,-3.435; 21 -0.2,-3.435; 22 0.2,-3.435; 23 0.6,-3.435; 24 1,-3.435; 25 1.4,-3.435; 26 1.8,-3.435; 27 2.2,-3.435; 28 2.6,-3.435; 43 2.6,3.435; 44 2.2,3.435; 45 1.8,3.435; 46 1.4,3.435; 47 1,3.435; 48 0.6,3.435; 49 0.2,3.435; 50 -0.2,3.435; 51 -0.6,3.435; 52 -1,3.435; 53 -1.4,3.435; 54 -1.8,3.435; 55 -2.2,3.435; 56 -2.6,3.435 | smd 3.1 x 3.1: 57 0,0
SOIC127P790X216-8N = smd 1.61 x 0.58: 1 -3.605,1.905; 2 -3.605,0.635; 3 -3.605,-0.635; 4 -3.605,-1.905; 5 3.605,-1.905; 6 3.605,-0.635; 7 3.605,0.635; 8 3.605,1.905
SOT-23 = smd 1.016 x 1.2: 1 -0.95,-1.06; 2 0.95,-1.06; 3 0,1.06
MXHSPCB-1U = smd 3.058 x 2.5: MX1 7.614,2.54; MX2 -6.344,5.08 | drill 0.25 pad 0.406: P$1 7.62,3.175; P$2 7.62,1.905; P$3 -6.35,5.715; P$4 -6.35,4.445 | hole 4: 0,0 | hole 1.778: 5.08,0; -5.08,0 | hole 2.997: 3.81,2.54; -2.54,5.08
MXHSPCB-2U-FLIPPED = smd 3.058 x 2.5: MX1 7.614,2.54; MX2 -6.344,5.08 | drill 0.2 pad 0.406: P$1 7.62,3.175; P$2 7.62,1.905; P$3 -6.35,5.715; P$4 -6.35,4.445 | hole 4: 0,0; -11.9,8.24; 11.9,8.24 | hole 1.802: 5.08,0; -5.08,0 | hole 3: 3.81,2.54; -2.54,5.08 | hole 3.05: -11.9,-7; 11.9,-7
LED-3535 = smd 2.216 x 0.8: 1 -2.133,0.875; 2 -2.133,-0.875; 3 2.133,-0.875; 4 2.133,0.875
CRYSTAL-3.2X2.5 = smd 1.3 x 1.05: 1 -1.15,-0.925; 2 1.15,-0.925; 3 1.15,0.925; 4 -1.15,0.925

### Placement (x,y rotation side)
BOOT  14.25,-28.5 0 top  (outside the outline)
C1  16.62,-33.25 0 top  (outside the outline)
C2  21.38,-33.25 0 top  (outside the outline)
C3  26.12,-33.25 0 top  (outside the outline)
C4  30.88,-33.25 0 top  (outside the outline)
C5  2.38,-38 0 top  (outside the outline)
C6  7.12,-38 0 top  (outside the outline)
C7  11.88,-38 0 top  (outside the outline)
C8  21.38,-42.75 0 top  (outside the outline)
C9  16.62,-38 0 top  (outside the outline)
C10  30.88,-38 0 top  (outside the outline)
C11  30.88,-26.12 0 top  (outside the outline)
C12  2.38,-33.25 0 top  (outside the outline)
C13  9.5,-33.25 0 top  (outside the outline)
C14  38,27.31 0 bottom
C15  38,23.75 180 bottom
C16  51.66,57 90 bottom
C17  45.72,57 90 bottom
D1  12.62,66.5 270 bottom
D2  25.4,66.5 270 bottom
D3  44.4,66.5 270 bottom
D4  69.62,66.5 270 bottom
D5  88.62,66.5 270 bottom
D6  107.62,66.5 270 bottom
D7  126.62,66.5 270 bottom
D8  145.69,66.5 270 bottom
D9  164.62,66.5 270 bottom
D10  183.62,66.5 270 bottom
D11  202.62,66.5 270 bottom
D12  221.62,66.5 270 bottom
D13  12.62,47.5 270 bottom
D14  17.37,47.5 270 bottom
D15  50.62,47.5 270 bottom
D16  69.62,47.5 270 bottom
D17  88.62,47.5 270 bottom
D18  107.62,47.5 270 bottom
D19  126.62,47.5 270 bottom
D20  145.62,47.5 270 bottom
D21  164.62,47.5 270 bottom
D22  183.62,47.5 270 bottom
D23  202.62,47.5 270 bottom
D24  221.62,47.5 270 bottom
D25  12.62,28.5 270 bottom
D26  31.62,28.5 270 bottom
D27  50.62,28.5 270 bottom
D28  69.62,28.5 270 bottom
D29  88.62,28.5 270 bottom
D30  107.62,28.5 270 bottom
D31  126.62,28.5 270 bottom
D32  145.62,28.5 270 bottom
D33  164.62,28.5 270 bottom
D34  183.62,28.5 270 bottom
D35  202.62,28.5 270 bottom
D36  221.62,28.5 270 bottom
D37  12.62,9.5 270 bottom
D38  31.62,9.5 270 bottom
D39  50.62,9.5 270 bottom
D40  69.62,9.5 270 bottom
D41  88.62,9.5 270 bottom
D42  117.12,9.5 270 bottom
D43  37.41,59.38 0 bottom
D44  145.62,9.5 270 bottom
D45  164.62,9.5 270 bottom
D46  183.62,9.5 270 bottom
D47  202.62,9.5 270 bottom
D48  221.62,9.5 270 bottom
J1  38,76 180 bottom
J2  30.88,-21.38 0 top  (outside the outline)
JP3  21.38,-28.5 0 top  (outside the outline)
JP4  26.12,-28.5 0 top  (outside the outline)
R1  36.22,55.81 90 bottom
R2  37.7,55.81 90 bottom
R3  26.12,-42.75 0 top  (outside the outline)
R4  38,25.53 0 bottom
R5  2.38,-47.5 0 top  (outside the outline)
R6  45.72,74.81 180 bottom
R7  30.28,74.81 0 bottom
R39  42.75,57 90 bottom
RESET  7.12,-28.5 0 top  (outside the outline)
U1  38,40.38 0 bottom
U2  57,39.78 0 bottom
U4  48.69,57 0 bottom
U$1  9.5,66.5 0 bottom
U$2  28.5,66.5 180 bottom
U$3  47.5,66.5 180 bottom
U$4  66.5,66.5 0 bottom
U$5  85.5,66.5 0 bottom
U$6  104.5,66.5 0 bottom
U$7  123.5,66.5 0 bottom
U$8  142.5,66.5 0 bottom
U$9  161.5,66.5 0 bottom
U$10  180.5,66.5 0 bottom
U$11  199.5,66.5 0 bottom
U$12  218.5,66.5 0 bottom
U$13  9.5,47.5 0 bottom
U$14  28.5,47.5 0 bottom
U$15  47.5,47.5 0 bottom
U$16  66.5,47.5 0 bottom
U$17  85.5,47.5 0 bottom
U$18  104.5,47.5 0 bottom
U$19  123.5,47.5 0 bottom
U$20  142.5,47.5 0 bottom
U$21  161.5,47.5 0 bottom
U$22  180.5,47.5 0 bottom
U$23  199.5,47.5 0 bottom
U$24  218.5,47.5 0 bottom
U$25  9.5,28.5 0 bottom
U$26  28.5,28.5 0 bottom
U$27  47.5,28.5 0 bottom
U$28  66.5,28.5 0 bottom
U$29  85.5,28.5 0 bottom
U$30  104.5,28.5 0 bottom
U$31  123.5,28.5 0 bottom
U$32  142.5,28.5 0 bottom
U$33  161.5,28.5 0 bottom
U$34  180.5,28.5 0 bottom
U$35  199.5,28.5 0 bottom
U$36  218.5,28.5 0 bottom
U$37  9.5,9.5 0 bottom
U$38  28.5,9.5 0 bottom
U$39  47.5,9.5 0 bottom
U$40  66.5,9.5 0 bottom
U$41  85.5,9.5 0 bottom
U$42  114,9.5 0 bottom
U$43  9.5,61.45 180 bottom
U$44  142.5,9.5 0 bottom
U$45  161.5,9.5 0 bottom
U$46  180.5,9.5 0 bottom
U$47  199.5,9.5 0 bottom
U$48  218.5,9.5 0 bottom
U$49  28.5,71.55 180 bottom
U$50  47.5,71.55 180 bottom
U$51  66.5,61.45 180 bottom
U$52  85.5,61.45 180 bottom
U$53  104.5,61.45 180 bottom
U$54  123.5,61.45 180 bottom
U$55  142.5,61.45 180 bottom
U$56  161.5,61.45 180 bottom
U$57  180.5,61.45 180 bottom
U$58  199.5,61.45 180 bottom
U$59  218.5,61.45 180 bottom
U$60  9.5,42.45 180 bottom
U$61  28.5,42.45 180 bottom
U$62  47.5,42.45 180 bottom
U$63  66.5,42.45 180 bottom
U$64  85.5,42.45 180 bottom
U$65  104.5,42.45 180 bottom
U$66  123.5,42.45 180 bottom
U$67  142.5,42.45 180 bottom
U$68  161.5,42.45 180 bottom
U$69  180.5,42.45 180 bottom
U$70  199.5,42.45 180 bottom
U$71  218.5,42.45 180 bottom
U$72  9.5,23.45 180 bottom
U$73  28.5,23.45 180 bottom
U$74  47.5,23.45 180 bottom
U$75  66.5,23.45 180 bottom
U$76  85.5,23.45 180 bottom
U$77  104.5,23.45 180 bottom
U$78  123.5,23.45 180 bottom
U$79  142.5,23.45 180 bottom
U$80  161.5,23.45 180 bottom
U$81  180.5,23.45 180 bottom
U$82  199.5,23.45 180 bottom
U$83  218.5,23.45 180 bottom
U$84  9.5,4.45 180 bottom
U$85  28.5,4.45 180 bottom
U$86  47.5,4.45 180 bottom
U$87  66.5,4.45 180 bottom
U$88  85.5,4.45 180 bottom
U$89  114,4.45 180 bottom
U$90  142.5,4.45 180 bottom
U$91  161.5,4.45 180 bottom
U$92  180.5,4.45 180 bottom
U$93  199.5,4.45 180 bottom
U$94  218.5,4.45 180 bottom
Y1  38,20.19 270 bottom

### Tracks (layer width: path | path; a pad name or v marks a point on that pad's centre or on a via)
1V  (5 unrouted)
3.3V  (23 unrouted)
CLK  (1 unrouted)
DIO  (1 unrouted)
DN-  (2 unrouted)
DP+  (2 unrouted)
GND  (72 unrouted)
GND1  (8 unrouted)
N$1  (via drill 2.5 pad 4)
  other vias: 57,57
N$2  (via drill 2.5 pad 4)
  other vias: 19,38
N$3  (via drill 2.5 pad 4)
  other vias: 57,19
N$4  (via drill 2.5 pad 4)
  other vias: 209,38
N$5  (via drill 2.5 pad 4)
  other vias: 171,57
N$6  (via drill 2.5 pad 4)
  other vias: 171,19
N$7  (3 unrouted)
N$8  (3 unrouted)
N$9  (3 unrouted)
N$10  (3 unrouted)
N$11  (3 unrouted)
N$12  (3 unrouted)
N$13  (3 unrouted)
N$14  (3 unrouted)
N$15  (3 unrouted)
N$16  (3 unrouted)
N$17  (3 unrouted)
N$18  (3 unrouted)
N$19  (3 unrouted)
N$20  (3 unrouted)
N$21  (3 unrouted)
N$22  (3 unrouted)
N$23  (3 unrouted)
N$24  (3 unrouted)
N$25  (3 unrouted)
N$26  (3 unrouted)
N$27  (3 unrouted)
N$28  (3 unrouted)
N$29  (3 unrouted)
N$30  (3 unrouted)
N$31  (3 unrouted)
N$32  (3 unrouted)
N$33  (3 unrouted)
N$34  (3 unrouted)
N$35  (3 unrouted)
N$36  (3 unrouted)
N$37  (3 unrouted)
N$38  (3 unrouted)
N$39  (3 unrouted)
N$40  (3 unrouted)
N$41  (3 unrouted)
N$42  (3 unrouted)
N$43  (3 unrouted)
N$44  (3 unrouted)
N$45  (3 unrouted)
N$46  (3 unrouted)
N$47  (3 unrouted)
N$48  (3 unrouted)
N$49  (3 unrouted)
N$50  (3 unrouted)
N$51  (3 unrouted)
N$52  (3 unrouted)
N$53  (3 unrouted)
N$54  (1 unrouted)
N$55  (1 unrouted)
N$56  (1 unrouted)
N$57  (1 unrouted)
N$58  (1 unrouted)
N$59  (1 unrouted)
N$60  (1 unrouted)
N$61  (1 unrouted)
N$62  (1 unrouted)
N$63  (1 unrouted)
N$64  (1 unrouted)
N$65  (1 unrouted)
N$66  (1 unrouted)
N$67  (1 unrouted)
N$68  (1 unrouted)
N$69  (1 unrouted)
N$70  (1 unrouted)
N$71  (1 unrouted)
N$72  (1 unrouted)
N$73  (1 unrouted)
N$74  (1 unrouted)
N$75  (1 unrouted)
N$76  (1 unrouted)
N$77  (1 unrouted)
N$78  (1 unrouted)
N$79  (1 unrouted)
N$80  (1 unrouted)
N$81  (1 unrouted)
N$82  (1 unrouted)
N$83  (1 unrouted)
N$84  (1 unrouted)
N$85  (1 unrouted)
N$86  (1 unrouted)
N$87  (1 unrouted)
N$88  (1 unrouted)
N$89  (1 unrouted)
N$90  (1 unrouted)
N$91  (1 unrouted)
N$92  (1 unrouted)
N$93  (1 unrouted)
N$94  (1 unrouted)
N$95  (1 unrouted)
N$96  (1 unrouted)
N$97  (1 unrouted)
N$98  (1 unrouted)
N$99  (2 unrouted)
N$100  (1 unrouted)
N$101  (3 unrouted)
N$153  (1 unrouted)
N$154  (1 unrouted)
RST  (3 unrouted)
SCLK  (1 unrouted)
SD0  (1 unrouted)
SD1  (1 unrouted)
SD2  (1 unrouted)
SD3  (1 unrouted)
SS  (2 unrouted)
VCC  (1 unrouted)
VDD  (46 unrouted)
XTAL1  (1 unrouted)
XTAL2  (2 unrouted)